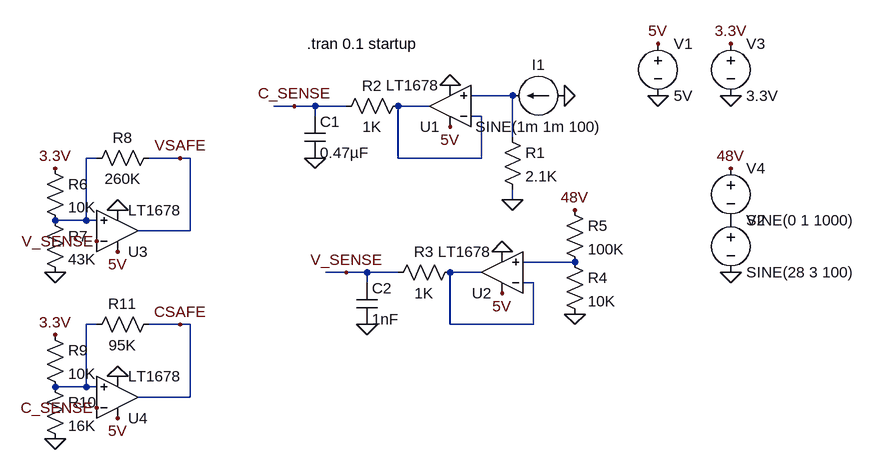
[diagram p0: schematic InstrumentationTest.asc]
InstrumentationTest.asc, the LTspice schematic file:
Version 4
SHEET 1 880 732
WIRE 224 160 160 160
WIRE -112 176 -144 176
WIRE -80 176 -112 176
WIRE -32 176 -80 176
WIRE 96 176 48 176
WIRE -80 192 -80 176
WIRE 176 192 160 192
WIRE 224 224 224 160
WIRE -416 256 -432 256
WIRE -288 256 -336 256
WIRE -272 256 -288 256
WIRE 48 256 48 176
WIRE 176 256 176 192
WIRE 176 256 48 256
WIRE 224 320 224 304
WIRE -432 352 -432 256
WIRE -432 352 -480 352
WIRE -416 352 -432 352
WIRE -272 368 -272 256
WIRE -272 368 -352 368
WIRE 320 416 240 416
WIRE -32 432 -64 432
WIRE 0 432 -32 432
WIRE 48 432 0 432
WIRE 176 432 128 432
WIRE 0 448 0 432
WIRE 256 448 240 448
WIRE -416 512 -432 512
WIRE -288 512 -336 512
WIRE -272 512 -288 512
WIRE 128 512 128 432
WIRE 256 512 256 448
WIRE 256 512 128 512
WIRE -432 608 -432 512
WIRE -432 608 -480 608
WIRE -416 608 -432 608
WIRE -272 624 -272 512
WIRE -272 624 -352 624
FLAG 224 320 0
FLAG -112 176 C_SENSE
FLAG 448 160 0
FLAG 448 80 5V
FLAG 128 208 5V
FLAG -80 256 0
FLAG 128 144 0
FLAG 304 160 0
FLAG 560 432 0
FLAG 560 272 48V
FLAG -32 432 V_SENSE
FLAG 208 464 5V
FLAG 0 512 0
FLAG 208 400 0
FLAG 320 336 48V
FLAG 320 496 0
FLAG 560 160 0
FLAG 560 80 3.3V
FLAG -480 272 3.3V
FLAG -416 384 V_SENSE
FLAG -384 400 5V
FLAG -384 336 0
FLAG -480 432 0
FLAG -288 256 VSAFE
FLAG -480 528 3.3V
FLAG -416 640 C_SENSE
FLAG -384 656 5V
FLAG -384 592 0
FLAG -480 688 0
FLAG -288 512 CSAFE
SYMBOL res 208 208 R0
SYMATTR InstName R1
SYMATTR Value 2.1K
SYMBOL Opamps\\LT1678 128 176 R180
SYMATTR InstName U1
SYMBOL res 64 160 R90
WINDOW 0 0 56 VBottom 2
WINDOW 3 32 56 VTop 2
SYMATTR InstName R2
SYMATTR Value 1K
SYMBOL cap -96 192 R0
SYMATTR InstName C1
SYMATTR Value 0.47µF
SYMBOL voltage 448 64 R0
SYMATTR InstName V1
SYMATTR Value 5V
SYMBOL current 304 160 R90
WINDOW 0 -32 40 VBottom 2
WINDOW 3 32 40 VTop 2
WINDOW 123 0 0 Left 0
WINDOW 39 0 0 Left 0
SYMATTR InstName I1
SYMATTR Value SINE(1m 1m 100)
SYMBOL voltage 560 336 R0
WINDOW 123 0 0 Left 0
WINDOW 39 0 0 Left 0
SYMATTR InstName V2
SYMATTR Value SINE(28 3 100)
SYMBOL Opamps\\LT1678 208 432 R180
SYMATTR InstName U2
SYMBOL res 144 416 R90
WINDOW 0 0 56 VBottom 2
WINDOW 3 32 56 VTop 2
SYMATTR InstName R3
SYMATTR Value 1K
SYMBOL cap -16 448 R0
SYMATTR InstName C2
SYMATTR Value 1nF
SYMBOL res 304 400 R0
SYMATTR InstName R4
SYMATTR Value 10K
SYMBOL res 304 320 R0
SYMATTR InstName R5
SYMATTR Value 100K
SYMBOL Opamps\\LT1678 -384 368 M180
SYMATTR InstName U3
SYMBOL res -496 256 R0
SYMATTR InstName R6
SYMATTR Value 10K
SYMBOL res -496 336 R0
SYMATTR InstName R7
SYMATTR Value 43K
SYMBOL voltage 560 64 R0
SYMATTR InstName V3
SYMATTR Value 3.3V
SYMBOL res -320 240 R90
WINDOW 0 0 56 VBottom 2
WINDOW 3 32 56 VTop 2
SYMATTR InstName R8
SYMATTR Value 260K
SYMBOL Opamps\\LT1678 -384 624 M180
SYMATTR InstName U4
SYMBOL res -496 512 R0
SYMATTR InstName R9
SYMATTR Value 10K
SYMBOL res -496 592 R0
SYMATTR InstName R10
SYMATTR Value 16K
SYMBOL res -320 496 R90
WINDOW 0 0 56 VBottom 2
WINDOW 3 32 56 VTop 2
SYMATTR InstName R11
SYMATTR Value 95K
SYMBOL voltage 560 256 R0
WINDOW 123 0 0 Left 0
WINDOW 39 0 0 Left 0
SYMATTR InstName V4
SYMATTR Value SINE(0 1 1000)
TEXT -92 80 Left 2 !.tran 0.1 startup

The netlist it stands for:
* InstrumentationTest.asc
R1 N001 0 2.1K
XU1 N001 N002 N002 5V 0 LT1678  ; pins In+ In- OUT V+ V-
R2 N002 C_SENSE 1K
C1 C_SENSE 0 0.47µF
V1 5V 0 5V
I1 0 N001 SINE(1m 1m 100)
V2 P001 0 SINE(28 3 100)
XU2 N004 N005 N005 5V 0 LT1678  ; pins In+ In- OUT V+ V-
R3 N005 V_SENSE 1K
C2 V_SENSE 0 1nF
R4 N004 0 10K
R5 48V N004 100K
XU3 N003 V_SENSE VSAFE 5V 0 LT1678  ; pins In+ In- OUT V+ V-
R6 3.3V N003 10K
R7 N003 0 43K
V3 3.3V 0 3.3V
R8 VSAFE N003 260K
XU4 N006 C_SENSE CSAFE 5V 0 LT1678  ; pins In+ In- OUT V+ V-
R9 3.3V N006 10K
R10 N006 0 16K
R11 CSAFE N006 95K
V4 48V P001 SINE(0 1 1000)
.tran 0.1 startup
.backanno
.end

* Results of the author's LTspice run, read from the files saved beside the schematic
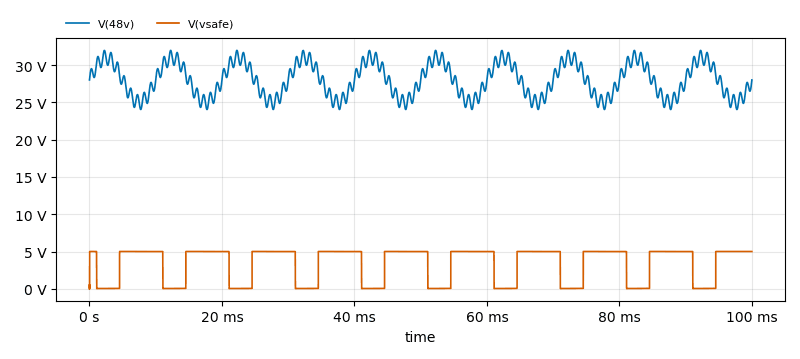
[diagram p1: Transient Analysis of InstrumentationTest.asc, plotted from the saved traces]
* Transient Analysis, 1 run:
*   V(48v): min 24.04 V, max 31.96 V, average 28 V, rms 28.09 V, last 28 V
*   V(vsafe): min 0 V, max 5 V, average 3.274 V, rms 4.037 V, last 5 V